# Altium schematic sheet am2067_4R_PCB.SchDoc: Pearl ISL-IP AM2067-4R
size A3; Author: Claude Laurent; Organization: GomSpace ApS; Address1: Langagervej 6; Address2: 9220 Aalborg East; Revision: 1; SheetNumber: 1; SheetTotal: 1; Time: 24 JANUARY 2018; ProjectName: PEARL
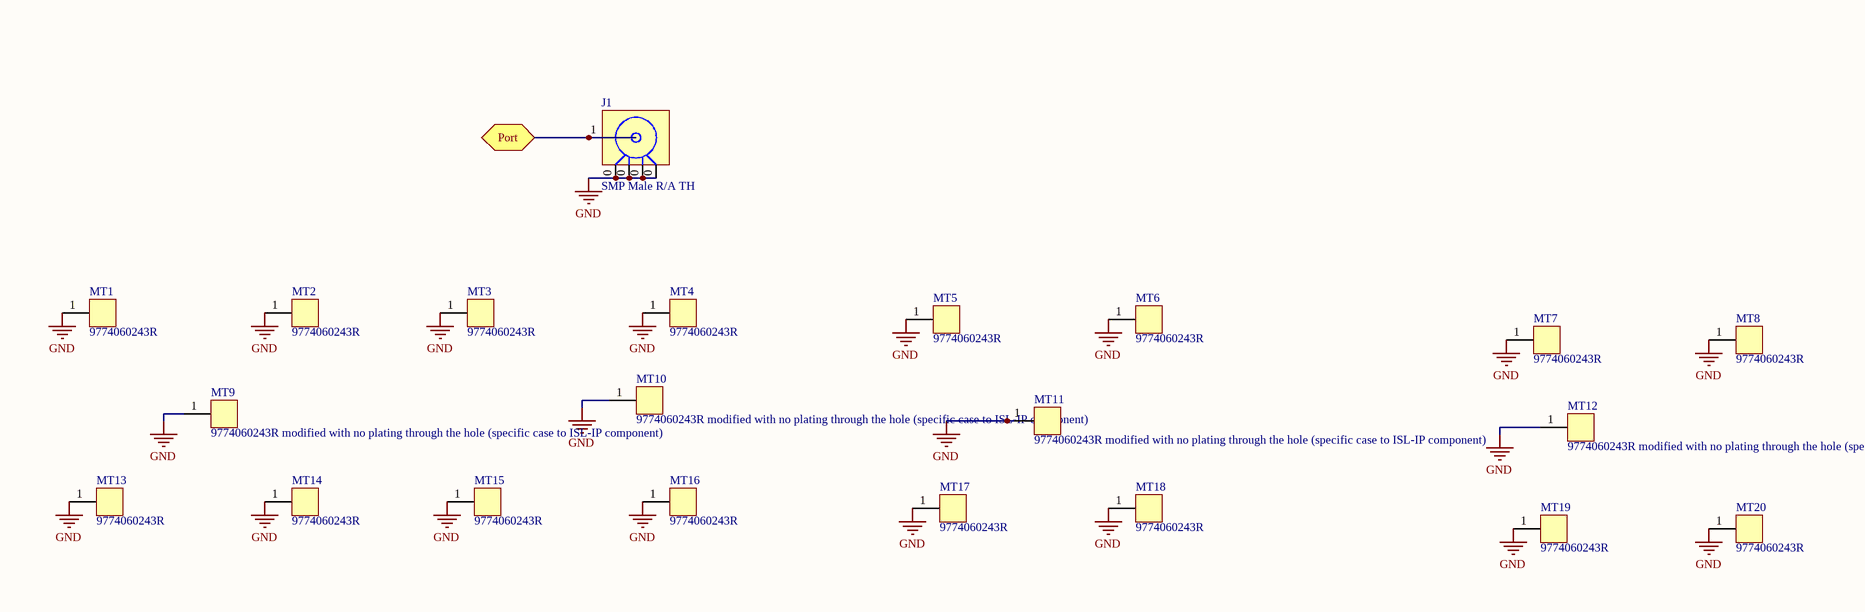
[diagram p0: am2067_4R_PCB.SchDoc, bottom left]

## Parts
J1  SMP Male R/A TH  [SF1212-6000-TD]
MT1  9774060243R  [SMT_spacer_M2_6mm]
MT2  9774060243R  [SMT_spacer_M2_6mm]
MT3  9774060243R  [SMT_spacer_M2_6mm]
MT4  9774060243R  [SMT_spacer_M2_6mm]
MT5  9774060243R  [SMT_spacer_M2_6mm]
MT6  9774060243R  [SMT_spacer_M2_6mm]
MT7  9774060243R  [SMT_spacer_M2_6mm]
MT8  9774060243R  [SMT_spacer_M2_6mm]
MT9  9774060243R modified with no plating through the hole (specific case to ISL-IP component)  [SMT_spacer_M2_6mm differentiation with CMP-024-0033]
MT10  9774060243R modified with no plating through the hole (specific case to ISL-IP component)  [SMT_spacer_M2_6mm differentiation with CMP-024-0033]
MT11  9774060243R modified with no plating through the hole (specific case to ISL-IP component)  [SMT_spacer_M2_6mm differentiation with CMP-024-0033]
MT12  9774060243R modified with no plating through the hole (specific case to ISL-IP component)  [SMT_spacer_M2_6mm differentiation with CMP-024-0033]
MT13  9774060243R  [SMT_spacer_M2_6mm]
MT14  9774060243R  [SMT_spacer_M2_6mm]
MT15  9774060243R  [SMT_spacer_M2_6mm]
MT16  9774060243R  [SMT_spacer_M2_6mm]
MT17  9774060243R  [SMT_spacer_M2_6mm]
MT18  9774060243R  [SMT_spacer_M2_6mm]
MT19  9774060243R  [SMT_spacer_M2_6mm]
MT20  9774060243R  [SMT_spacer_M2_6mm]

## Ports
Port

## Nets
GND: J1.0 MT1.1 MT2.1 MT3.1 MT4.1 MT5.1 MT6.1 MT7.1 MT8.1 MT9.1 MT10.1 MT11.1 MT12.1 MT13.1 MT14.1 MT15.1 MT16.1 MT17.1 MT18.1 MT19.1 MT20.1
Port: J1.1 ; port Port

## Notes on the sheet
- Copyright © 2017 by
- Langagervej 6
- 9220 Aalborg East
- Confidential - DO NOT DISTRIBUTE
- GomSpace A/S
- Date:
- Author:
- Project:
- BOM Variant:
- EDA build number:
- Revision:
- Denmark
- File:
- Sheet:

## Library data of the parts
J1 = CMP-026-0147-5: SMP Male PCB Thru-Hole Connector, R/A, FD; Manufacturer: Amphenol / SV Microwave; Manufacturer number: SF1212-6000; InternalID: 100288; Height: 4.2mm
MT1-MT8 MT13-MT20 = CMP-024-0033-5: Pem nut, Surface Mount Nuts and Spacer, M2, 6mm; Manufacturer: Wurth Electronik; Part Number: SMTSO-M3-3ET; Old DB Number: 17000000; InternalID: 100666; Height: 6mm; Manufacturer number: 9774060243R; Part status: Prototype; Symbol Name: MT_hole_1
MT9-MT12 = CMP-024-0036-6: Pem nut, Surface Mount Nuts and Spacer, M2, 6mm; Manufacturer: Wurth Electronik; Part Number: SMTSO-M3-3ET; Old DB Number: 17000000; InternalID: 100666; Height: 6mm; Manufacturer number: 9774060243R; Part status: Prototype; Symbol Name: MT_hole_1